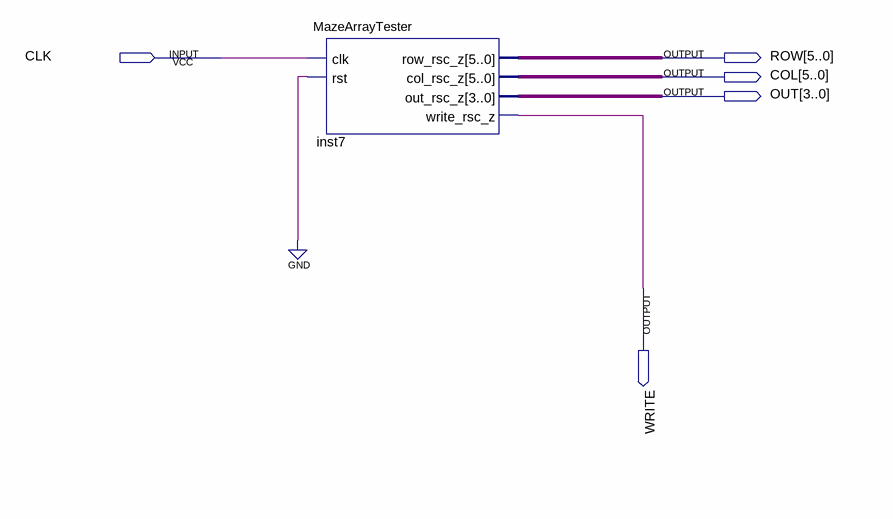
[diagram p0: schematic sheet]
// Quartus schematic MazeRAMTester.bdf as structural Verilog: 1 symbols, 5 pins
module MazeRAMTester (
  input  CLK,
  output [5:0] ROW,
  output [5:0] COL,
  output [3:0] OUT,
  output WRITE
);

  MazeArrayTester inst7 (.clk(CLK), .rst(1'b0), .row_rsc_z(ROW), .col_rsc_z(COL), .out_rsc_z(OUT), .write_rsc_z(WRITE));
endmodule
